# EAGLE design module_SX1278_type2 (EAGLE 9.4.1)
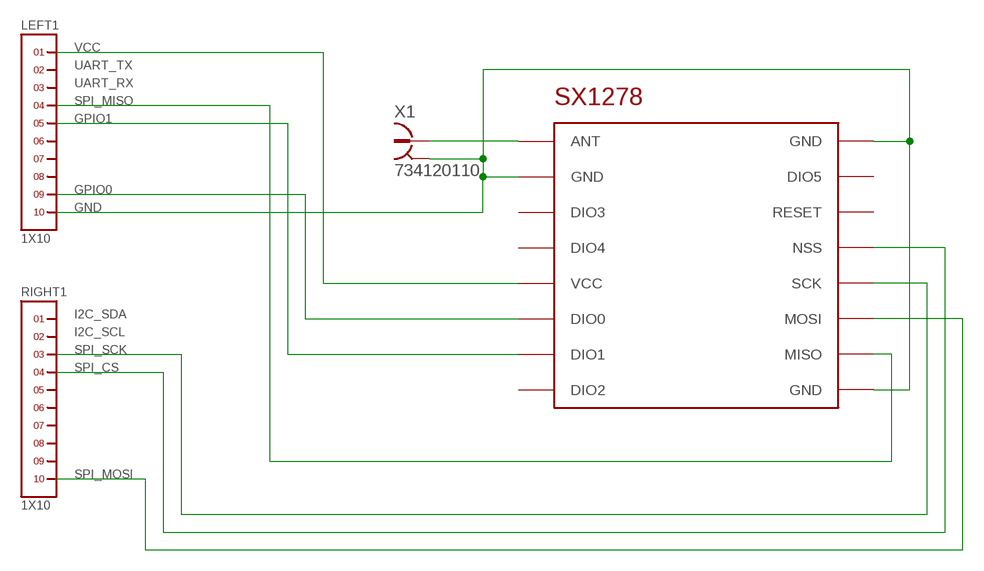
[diagram p0: schematic, sheet 1]

## Parts
LEFT1  1X10  [1X10]
RIGHT1  1X10  [1X10]
U$1  SX1278_2  [SX1278_2]
X1  734120110  [734120110]

## Nets
GND: LEFT1.10 U$1.GND@1(GND) U$1.GND@2(GND) U$1.GND@3(GND) X1.S@1 X1.S@2 X1.S@3
N$1: U$1.ANT X1.1
N$2: LEFT1.9 U$1.DIO0
N$3: RIGHT1.10 U$1.MOSI
N$4: RIGHT1.4 U$1.NSS
N$5: RIGHT1.3 U$1.SCK
N$6: LEFT1.5 U$1.DIO1
N$7: LEFT1.4 U$1.MISO
N$8: LEFT1.1 U$1.VCC
Unconnected: LEFT1.2 LEFT1.3 LEFT1.6 LEFT1.7 LEFT1.8 RIGHT1.1 RIGHT1.2 RIGHT1.5 RIGHT1.6 RIGHT1.7 RIGHT1.8 RIGHT1.9 U$1.DIO2 U$1.DIO3 U$1.DIO4 U$1.DIO5 U$1.RESET

## Notes on the sheet
- VCC
- UART_TX
- UART_RX
- SPI_MISO
- GPIO1
- GPIO0
- GND
- I2C_SDA
- I2C_SCL
- SPI_SCK
- SPI_CS
- SPI_MOSI

## Library data of the parts
LEFT1 RIGHT1 = headers(2mm):1X10
U$1 = RadioShield:SX1278_2
X1 = con-coax:734120110: MICRO COAXIAL CONNECTOR RECEPTACLE VERTICAL Source: Data sheet <http://www.molex.com/pdm_docs/sd/734120110_sd.pdf>

## Board
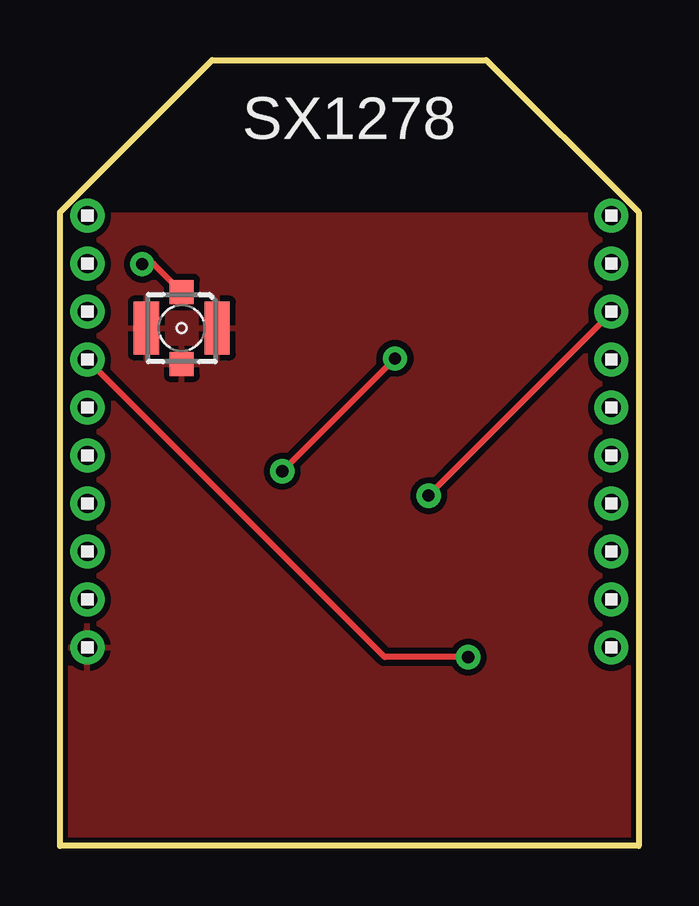
[diagram p1: board, top side]
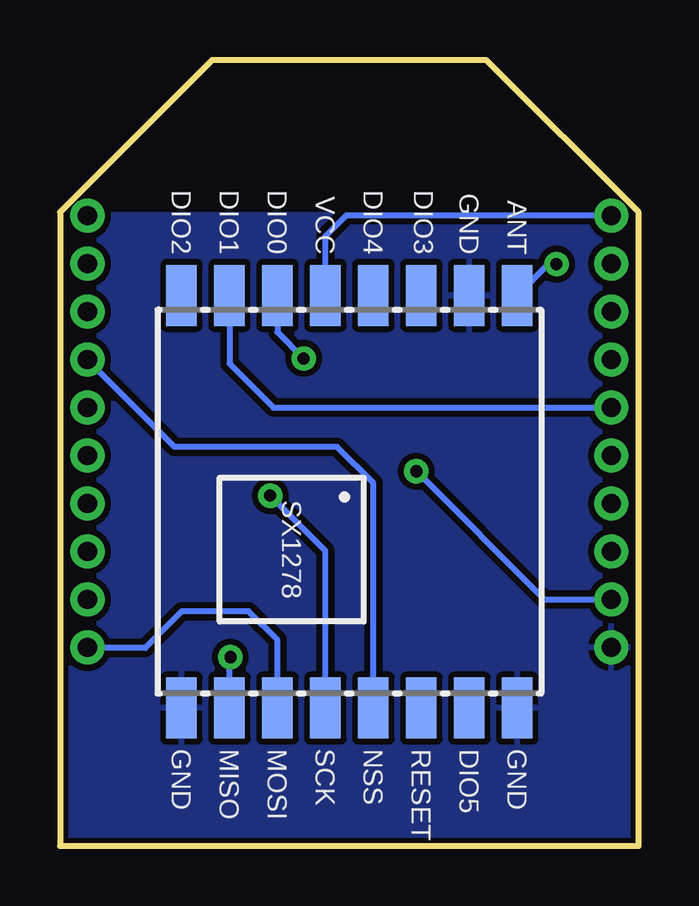
[diagram p2: board, bottom side, seen from below]

Size 24.13 x 32.77 mm. Coordinates in mm from the lower left corner, seen from the top.
Outline: 0,0 0,26.42 6.35,32.77 17.78,32.77 24.13,26.42 24.13,0 0,0
Copper layers (1*16): Top 0.035mm / dielectric 1.5mm / Bottom 0.035mm
Design rules "SparkFun-2-layer-STANDARD": minimum track width 10mil, minimum drill 20mil, track to track 10mil, track to pad 8mil, pad to pad 8mil, via to via 10mil, smd to smd 8mil, copper to edge 8mil, drill to drill 8mil, minimum pad ring 10mil, minimum via ring 10mil, stop-mask expansion 4mil, vias tented up to drill 25mil, thermal gap 10mil

### Footprints (pad centres in the part's own frame; a part is rotated, then mirrored left to right if it is on the bottom)
1X10 = drill 0.8 pad 1.422: 1 -9,0; 2 -7,0; 3 -5,0; 4 -3,0; 5 -1,0; 6 1,0; 7 3,0; 8 5,0; 9 7,0; 10 9,0
SX1278_2 = smd 2.54 x 1.27: ANT -8.6,7; DIO0 -8.6,-3; DIO1 -8.6,-5; DIO2 -8.6,-7; DIO3 -8.6,3; DIO4 -8.6,1; DIO5 8.6,5; GND@1 -8.6,5; GND@2 8.6,7; GND@3 8.6,-7; MISO 8.6,-5; MOSI 8.6,-3; NSS 8.6,1; RESET 8.6,3; SCK 8.6,-1; VCC -8.6,-1
734120110 = smd 1 x 1: 1 0,-1.5; S@1 0,1.5 | smd 1.05 x 2.2: S@2 -1.475,0; S@3 1.475,0

### Placement (x,y rotation side)
LEFT1  1.14,17.27 270 top
RIGHT1  22.99,17.27 270 top
U$1  12.06,14.35 270 bottom
X1  5.08,21.59 180 top

### Tracks (layer width: path | path; a pad name or v marks a point on that pad's centre or on a via)
GND
  pour Bottom: -0.51,-0.51 -0.51,26.29 24.64,26.29 24.64,-0.51
  pour Top: -0.25,-0.25 -0.25,26.29 24.38,26.29 24.38,-0.25
N$1  (via drill 0.51)
  Top 0.254: v3.43,24.26 3.91,24.26 X1.1
  Bottom 0.254: U$1.ANT 3.76,24.26 v3.43,24.26
N$2  (via drill 0.51)
  Top 0.254: v13.97,20.32 v9.27,15.62
  Bottom 0.254: U$1.DIO0 15.06,21.42 v13.97,20.32 | v9.27,15.62 3.92,10.27 LEFT1.9
N$3
  Bottom 0.254: U$1.MOSI 15.06,8.59 16.26,9.78 19.05,9.78 20.57,8.25 22.97,8.25 RIGHT1.10
N$4
  Bottom 0.254: U$1.NSS 11.06,15.13 12.57,16.64 19.35,16.64 RIGHT1.4
N$5  (via drill 0.51)
  Top 0.254: v15.37,14.6 22.99,22.23 RIGHT1.3
  Bottom 0.254: U$1.SCK 13.06,12.3 v15.37,14.6
N$6
  Bottom 0.254: U$1.DIO1 17.07,20.11 15.22,18.27 LEFT1.5
N$7  (via drill 0.51)
  Top 0.254: v17.02,7.87 13.54,7.87 LEFT1.4
  Bottom 0.254: U$1.MISO 17.07,7.83 v17.02,7.87
N$8
  Bottom 0.254: U$1.VCC 13.06,25.42 12.19,26.29 1.16,26.29 LEFT1.1

### Text on the board
tNames: SX1278